# EAGLE schematic nano Spot Welder 0.0.1 (EAGLE 8.7.1)
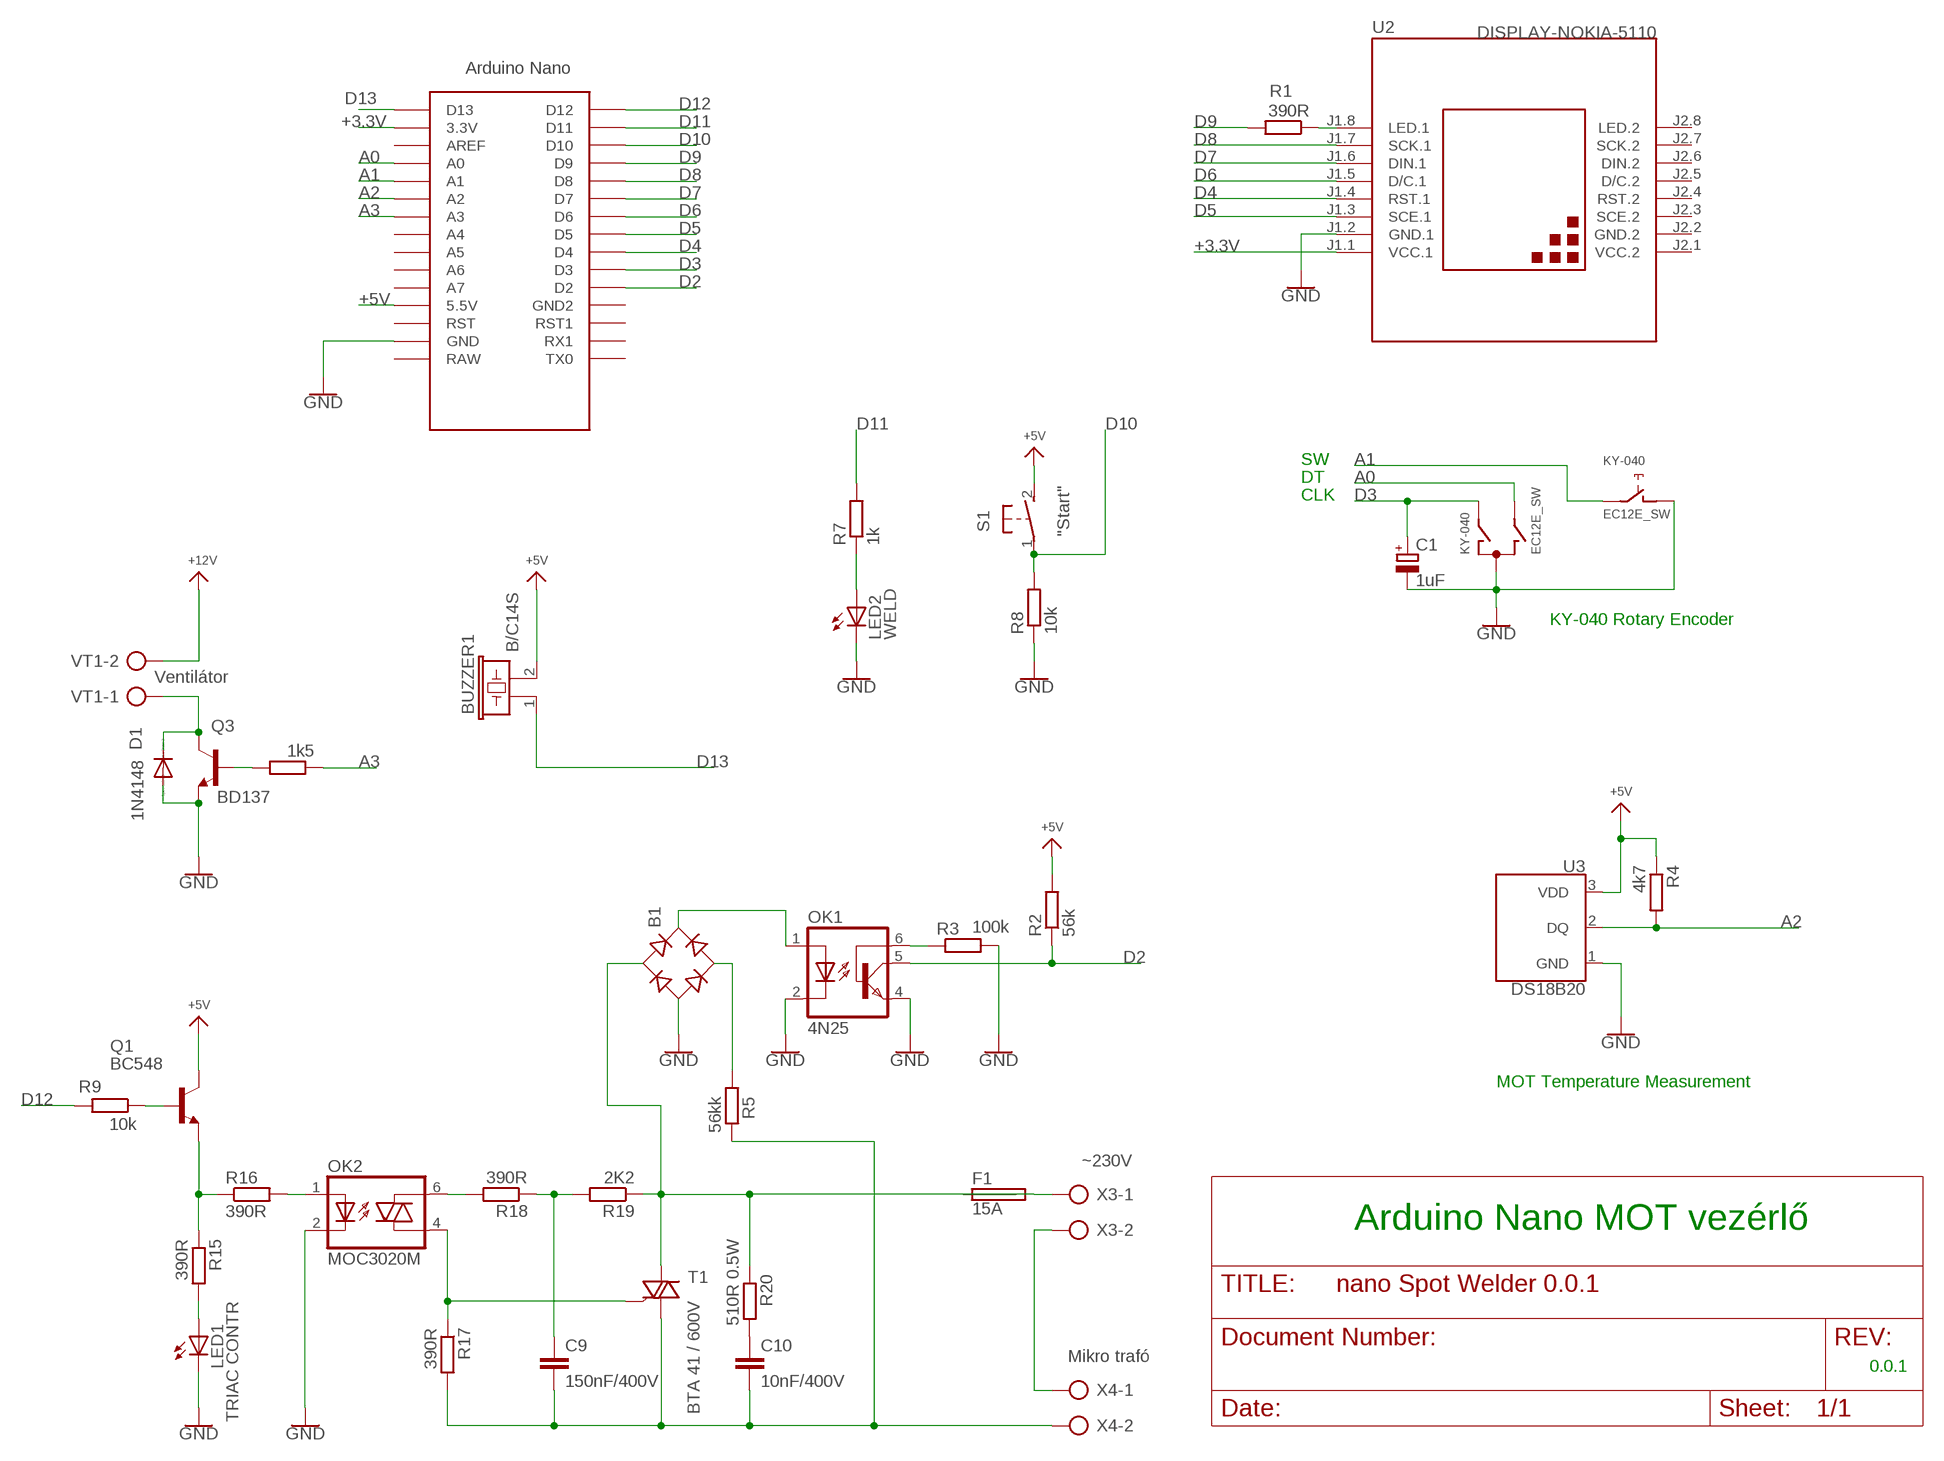
[diagram p0: schematic, sheet 1]

## Parts
B1  RB1A  [RB1A]
BUZZER1  B/C14S  [B/C14S]
C1  1uF  CPOL-EUE5-5  [E5-5]
C9  150nF/400V  C5/2.5  [C5B2.5]
C10  10nF/400V  C5/2.5  [C5B2.5]
D1  1N4148  1N4148DO35-10  [DO35-10]
F1  15A  GSH15  [GSH15]
KY-040  EC12E_SW  [ALPS_EC12E_SW]
LED1  TRIAC CONTR  LED  [SMARTLED-TTW]
LED2  WELD  LED  [SMARTLED-TTW]
OK1  4N25  4N35  [DIL06]
OK2  MOC3020M  [DIL06]
Q1  BC548  [TO92-EBC]
Q3  BD137  BC548  [TO92-EBC]
R1  390R  R-EU_0204/7  [0204/7]
R2  56k  R-EU_0204/7  [0204/7]
R3  100k  R-EU_0204/7  [0204/7]
R4  4k7  R-EU_0204/7  [0204/7]
R5  56kk  R-EU_0204/7  [0204/7]
R7  1k  R-EU_0204/7  [0204/7]
R8  10k  R-EU_0204/7  [0204/7]
R9  10k  R-EU_0204/7  [0204/7]
R10  1k5  R-EU_0204/7  [0204/7]
R15  390R  R-EU_0204/7  [0204/7]
R16  390R  R-EU_0204/7  [0204/7]
R17  390R  R-EU_0204/7  [0204/7]
R18  390R  R-EU_0204/7  [0204/7]
R19  2K2  R-EU_0204/7  [0204/7]
R20  510R 0.5W  R-EU_0204/7  [0204/7]
S1  31-XX  [B3F-31XX]
T1  BTA 41 / 600V  BT138-V  [TO220BV]
U1  NANO  [NANO]
U2  DISPLAY-NOKIA-5110  DISPLAY-NOKIA-3310  [DISPLAY-NOKIA-3310]
U3  DS18B20  [TO-92-AMMO]
VT1  Ventilátor  AK300/2  [AK300/2]
X3  ~230V  AK300/2  [AK300/2]
X4  Mikro trafó  AK300/2  [AK300/2]

## Nets
+3.3V: U1.3.3V U2.J1.1(VCC.1)
+5V: U1.5V(5.5V)
A0: KY-040.B U1.A0
A1: KY-040.E U1.A1
A2: R4.2 U1.A2 U3.2(DQ)
A3: R10.1 U1.A3
D2: OK1.5(COL) R2.1 U1.D2
D3: C1.+ KY-040.A U1.D3
D4: U1.D4 U2.J1.4(RST.1)
D5: U1.D5 U2.J1.3(SCE.1)
D6: U1.D6 U2.J1.5(D/C.1)
D7: U1.D7 U2.J1.6(DIN.1)
D8: U1.D8 U2.J1.7(SCK.1)
D9: R1.2 U1.D9
D10: R8.2 S1.1(P) U1.D10
D11: R7.2 U1.D11
D12: R9.2 U1.D12
D13: BUZZER1.1 U1.D13
GND: B1.- C1.- D1.A KY-040.C KY-040.D LED1.C@1(C) LED2.C@1(C) OK1.2(C) OK1.4(EMI) OK2.2(C) Q3.E R3.2 R8.1 U1.GND U2.J1.2(GND.1) U3.1(GND)
MOC: Q1.E R15.1 R16.1
N$1: R1.1 U2.J1.8(LED.1)
N$2: OK1.6(BAS) R3.1
N$3: B1.+ OK1.1(A)
N$4: Q1.B R9.1
N$5: Q3.B R10.2
N$6: D1.C Q3.C VT1.1
N$7: B1.AC2 R5.1
N$16: OK2.6(A2) R18.2
N$19: LED2.A@1(A) R7.1
N$20: LED1.A@1(A) R15.2
N$22: C9.1 R18.1 R19.2
N$23: OK2.4(A1) R17.1 T1.G
N$25: B1.AC1 F1.1 R19.1 R20.1 T1.T2(A2)
N$26: C10.1 R20.2
N$28: X3.2 X4.1
N$29: OK2.1(A) R16.2
N$31: F1.2 X3.1
N$33: C9.2 C10.2 R5.2 R17.2 T1.T1(A1) X4.2
VCC: BUZZER1.2 Q1.C R2.2 R4.1 S1.2(S) U3.3(VDD) VT1.2 ; supply symbol labelled +5V, +12V
Unconnected: KY-040.GND1(G) KY-040.GND2(G) U1.A4 U1.A5 U1.A6 U1.A7 U1.AREF U1.GND1(GND2) U1.ICSP1 U1.ICSP2 U1.ICSP3 U1.ICSP4 U1.ICSP5 U1.ICSP6 U1.RAW U1.RST U1.RST1 U1.RX1 U1.TX0 U2.J2.3(SCE.2) U2.J2.4(RST.2) U2.J2.5(D/C.2) U2.J2.6(DIN.2) U2.J2.7(SCK.2) U2.J2.8(LED.2)

## Notes on the sheet
- SW
- DT
- CLK
- KY-040 Rotary Encoder
- MOT Temperature Measurement
- Arduino Nano MOT vezérlő
- 0.0.1

## Power pins joined to a net without a drawn wire
GND.2: U2.J2.2(GND.2)
VCC.2: U2.J2.1(VCC.2)

## Library data of the parts
B1 = rectifier:RB1A: RECTIFIER 1 A
BUZZER1 = buzzer:B/C14S: BUZZER Source: Buerklin; OC_FARNELL: unknown; OC_NEWARK: unknown
C1 = rcl:CPOL-EU: POLARIZED CAPACITOR, European symbol; SPICEPREFIX: C
C9 C10 = capacitor-wima:C: CAPACITOR naming: grid - package width
D1 = diode:1N4148: DIODE high speed (Philips)
F1 = fuse:GSH15: FUSE HOLDER grid 15mm, 19649 Wickmann; MPN: 64900001039; OC_FARNELL: 1271673; OC_NEWARK: 02P0318
KY-040 = switch-alps:EC12E_SW: ALPS rotary Encoder EC12E series with switch; MPN: EC12E2424407; OC_FARNELL: 1520813; OC_NEWARK: 74M1068
LED1 LED2 = led:LED: LED OSRAM: - CHIPLED LG R971, LG N971, LY N971, LG Q971, LY Q971, LO R971, LY R971 LH N974, LH R974 LS Q976, LO Q976, LY Q976 LO Q996 - Hyper CHIPLED LW Q18S LB Q993, LB Q99A, LB R99A - SideLED LS A670, LO A670, LY A670, LG A670, LP A670 LB A673, LV A673, LT A673, LW A673 LH A674 LY A675 LS A676, LA A676, LO A676, LY A676, LW A676 LS A679, LY A679, LG A679 - Hyper Micro SIDELED® LS Y876, LA Y876, LO Y876, LY Y876 LT Y87S - SmartLED LW L88C, LW L88S LB L89C, LB L89S, LG L890 LS L89K, LO L89K, LY L89K LS L896, LA L896, LO L896, LY L896 - TOPLED LS T670, LO T670, LY T670, LG T670, LP T670 LSG T670, LSP T670, LSY T670, LOP T670, LYG T670 LG T671, LOG T671, LSG T671 LB T673, LV T673, LT T673, LW T673 LH T674 LS T676, LA T676, LO T676, LY T676, LB T676, LH T676, LSB T676, LW T676 LB T67C, LV T67C, LT T67C, LS T67K, LO T67K, LY T67K, LW E67C LS E67B, LA E67B, LO E67B, LY E67B, LB E67C, LV E67C, LT E67C LW T67C LS T679, LY T679, LG T679 LS T770, LO T770, LY T770, LG T770, LP T770 LB T773, LV T773, LT T773, LW T773 LH T774 LS E675, LA E675, LY E675, LS T675 LS T776, LA T776, LO T776, LY T776, LB T776 LHGB T686 LT T68C, LB T68C - Hyper Mini TOPLED® LB M676 - Mini TOPLED Santana® LG M470 LS M47K, LO M47K, LY M47K Source: http://www.osram.convergy.de LUXEON: - LUMILED® LXK2-PW12-R00, LXK2-PW12-S00, LXK2-PW14-U00, LXK2-PW14-V00 LXK2-PM12-R00, LXK2-PM12-S00, LXK2-PM14-U00 LXK2-PE12-Q00, LXK2-PE12-R00, LXK2-PE12-S00, LXK2-PE14-T00, LXK2-PE14-U00 LXK2-PB12-K00, LXK2-PB12-L00, LXK2-PB12-M00, LXK2-PB14-N00, LXK2-PB14-P00, LXK2-PB14-Q00 LXK2-PR12-L00, LXK2-PR12-M00, LXK2-PR14-Q00, LXK2-PR14-R00 LXK2-PD12-Q00, LXK2-PD12-R00, LXK2-PD12-S00 LXK2-PH12-R00, LXK2-PH12-S00 LXK2-PL12-P00, LXK2-PL12-Q00, LXK2-PL12-R00 Source: www.luxeon.com KINGBRIGHT: KA-3528ASYC Source: www.kingbright.com
OK1 = optocoupler:4N35: MOTOROLA OPTO COUPLER; MF: FAIRCHILD SEMICONDUCTOR; MPN: 4N35; OC_FARNELL: 1328375; OC_NEWARK: 72K9946
OK2 = optocoupler-2:MOC30*M: RANDOM-PHASE OPTOISOLATORS TRIAC DRIVER OUTPUT Source: http://www.fairchildsemi.com MOC3020-M.pdf
Q1 Q3 = transistor-npn:BC548*: NPN Transistor
R1-R5 R7-R10 R15-R20 = resistor:R-EU_: RESISTOR, European symbol
S1 = switch-omron:31-XX: OMRON SWITCH; DESC: "Start"; MPN: B3F-3100; OC_FARNELL: 959704; OC_NEWARK: 36M3582
T1 = triac:BT138: TRIAC Source: http://www.semiconductors.philips.com BT138_SERIES_2.pdf
U1 = Arduino-clone:NANO: Arduino Nano
U2 = diy-modules:DISPLAY-NOKIA-3310: 84x48 Dot Matrix LCD Module based on Nokia 3310 display More details available here: https://arduinoandsoftware.wordpress.com/2012/12/30/nokia-33105110-3-3v-display-with-5v-arduino/
U3 = SparkFun-Sensors:DS18B20: Dallas/Maxim DS18B20 1-Wire Temperature Sensor The DS18B20 reports degrees C with 9 to 12-bit precision, -55C to 125C (+/-0.5C). Each sensor has a unique 64-Bit Serial number etched into it - allows for a huge number of sensors to be used on one data bus. Datasheet <http://datasheets.maximintegrated.com/en/ds/DS18B20.pdf> SparkFun Products One Wire Digital Temperature Sensor - DS18B20 <https://www.sparkfun.com/products/245> (SEN-00245); STORE_ID: SEN-00245
VT1 X3 X4 = con-ptr500:AK300/2: CONNECTOR; OC_FARNELL: unknown; OC_NEWARK: unknown